# EAGLE schematic wheelwriter (EAGLE 7.6.0)
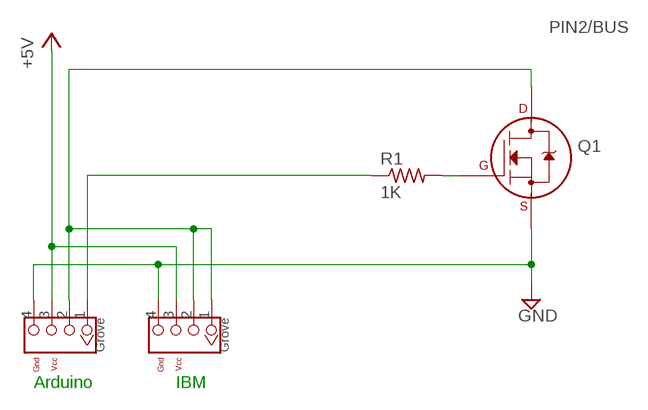
[diagram p0: schematic, sheet 1]

## Parts
J1  TWIG-4P-2.090D  [4P-2.0-90D]
J2  TWIG-4P-2.090D  [4P-2.0-90D]
Q1  2N7002A_SOT23  [SOT-23]
R1  1K  R-US_R1206  [R1206]

## Nets
+5V: J2.3
GND: J1.4 J2.4 Q1.2(S)
N$1: Q1.1(G) R1.2
N$4: J1.1 R1.1
PIN2/BUS: J1.2 J2.1 J2.2 Q1.3(D)
Unconnected: J1.3

## Notes on the sheet
- Arduino | IBM

## Library data of the parts
J1 J2 = Connector_grove:TWIG-4P-2.0
Q1 = transistors:2N700*: 2N7000, 2N7002, NDS7002A N-channel enhancement mode MOSFET
R1 = resistor:R-US_: RESISTOR, American symbol